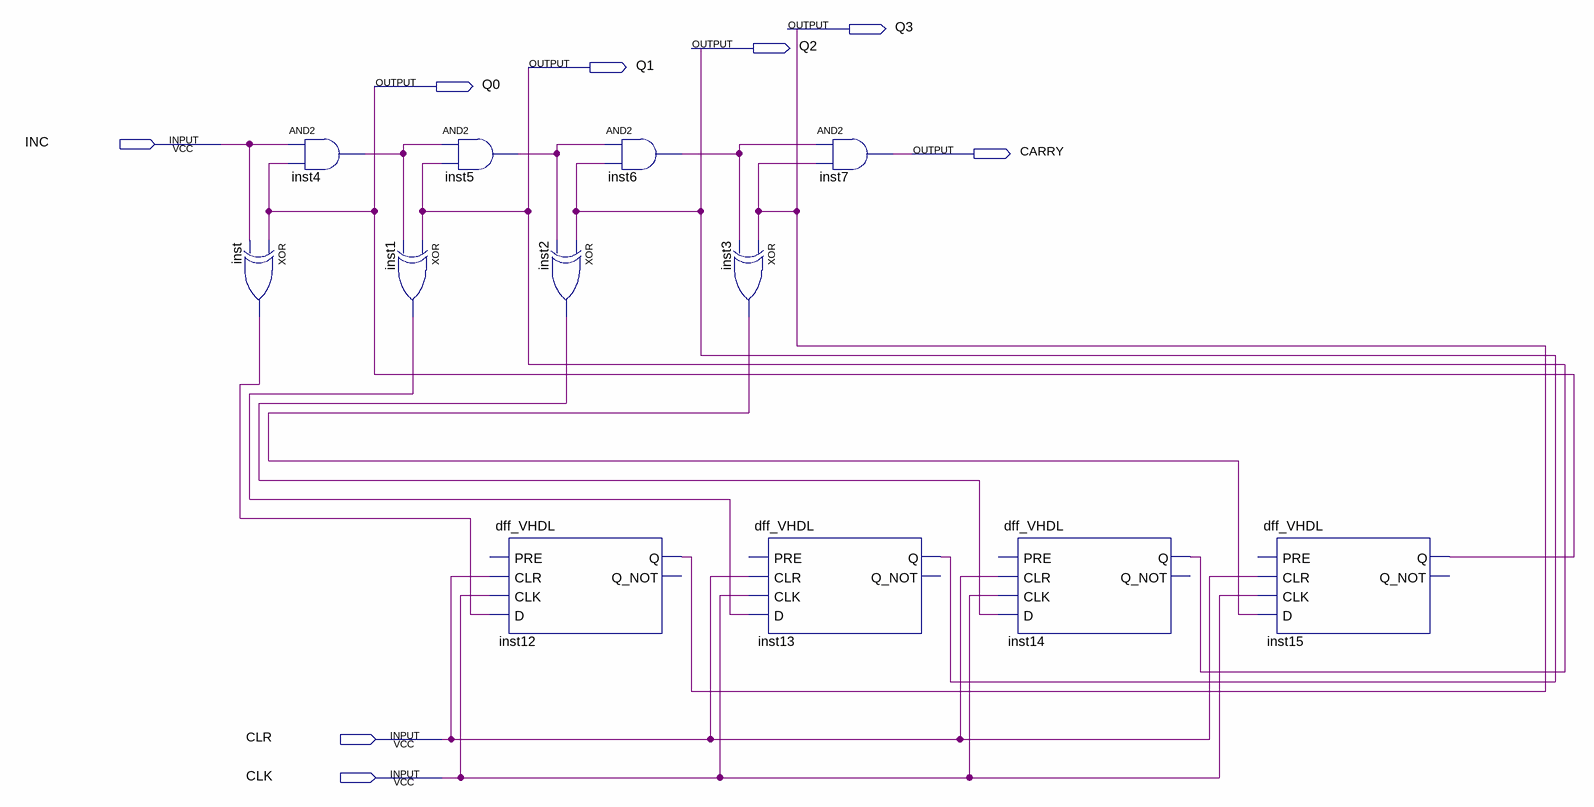
[diagram p0: schematic sheet]
// Quartus schematic SynchUpCount_NOLOAD_4bit.bdf as structural Verilog: 12 symbols, 8 pins
module SynchUpCount_NOLOAD_4bit (
  input  INC,
  input  CLR,
  input  CLK,
  output Q3,
  output Q2,
  output Q1,
  output Q0,
  output CARRY
);

  wire inst1_out, inst2_out, inst3_out, inst4_out, inst5_out, inst6_out, inst_out;

  xor inst (inst_out, Q0, INC);
  and inst4 (inst4_out, INC, Q0);
  xor inst1 (inst1_out, Q1, inst4_out);
  and inst5 (inst5_out, inst4_out, Q1);
  xor inst2 (inst2_out, Q2, inst5_out);
  dff_VHDL inst12 (.CLR(CLR), .CLK(CLK), .D(inst_out), .Q(Q3));  // open: PRE, Q_NOT
  and inst6 (inst6_out, inst5_out, Q2);
  xor inst3 (inst3_out, Q3, inst6_out);
  dff_VHDL inst13 (.CLR(CLR), .CLK(CLK), .D(inst1_out), .Q(Q2));  // open: PRE, Q_NOT
  and inst7 (CARRY, inst6_out, Q3);
  dff_VHDL inst14 (.CLR(CLR), .CLK(CLK), .D(inst2_out), .Q(Q1));  // open: PRE, Q_NOT
  dff_VHDL inst15 (.CLR(CLR), .CLK(CLK), .D(inst3_out), .Q(Q0));  // open: PRE, Q_NOT
endmodule
